# EAGLE design brick_serial_universal (EAGLE 7.4.0)
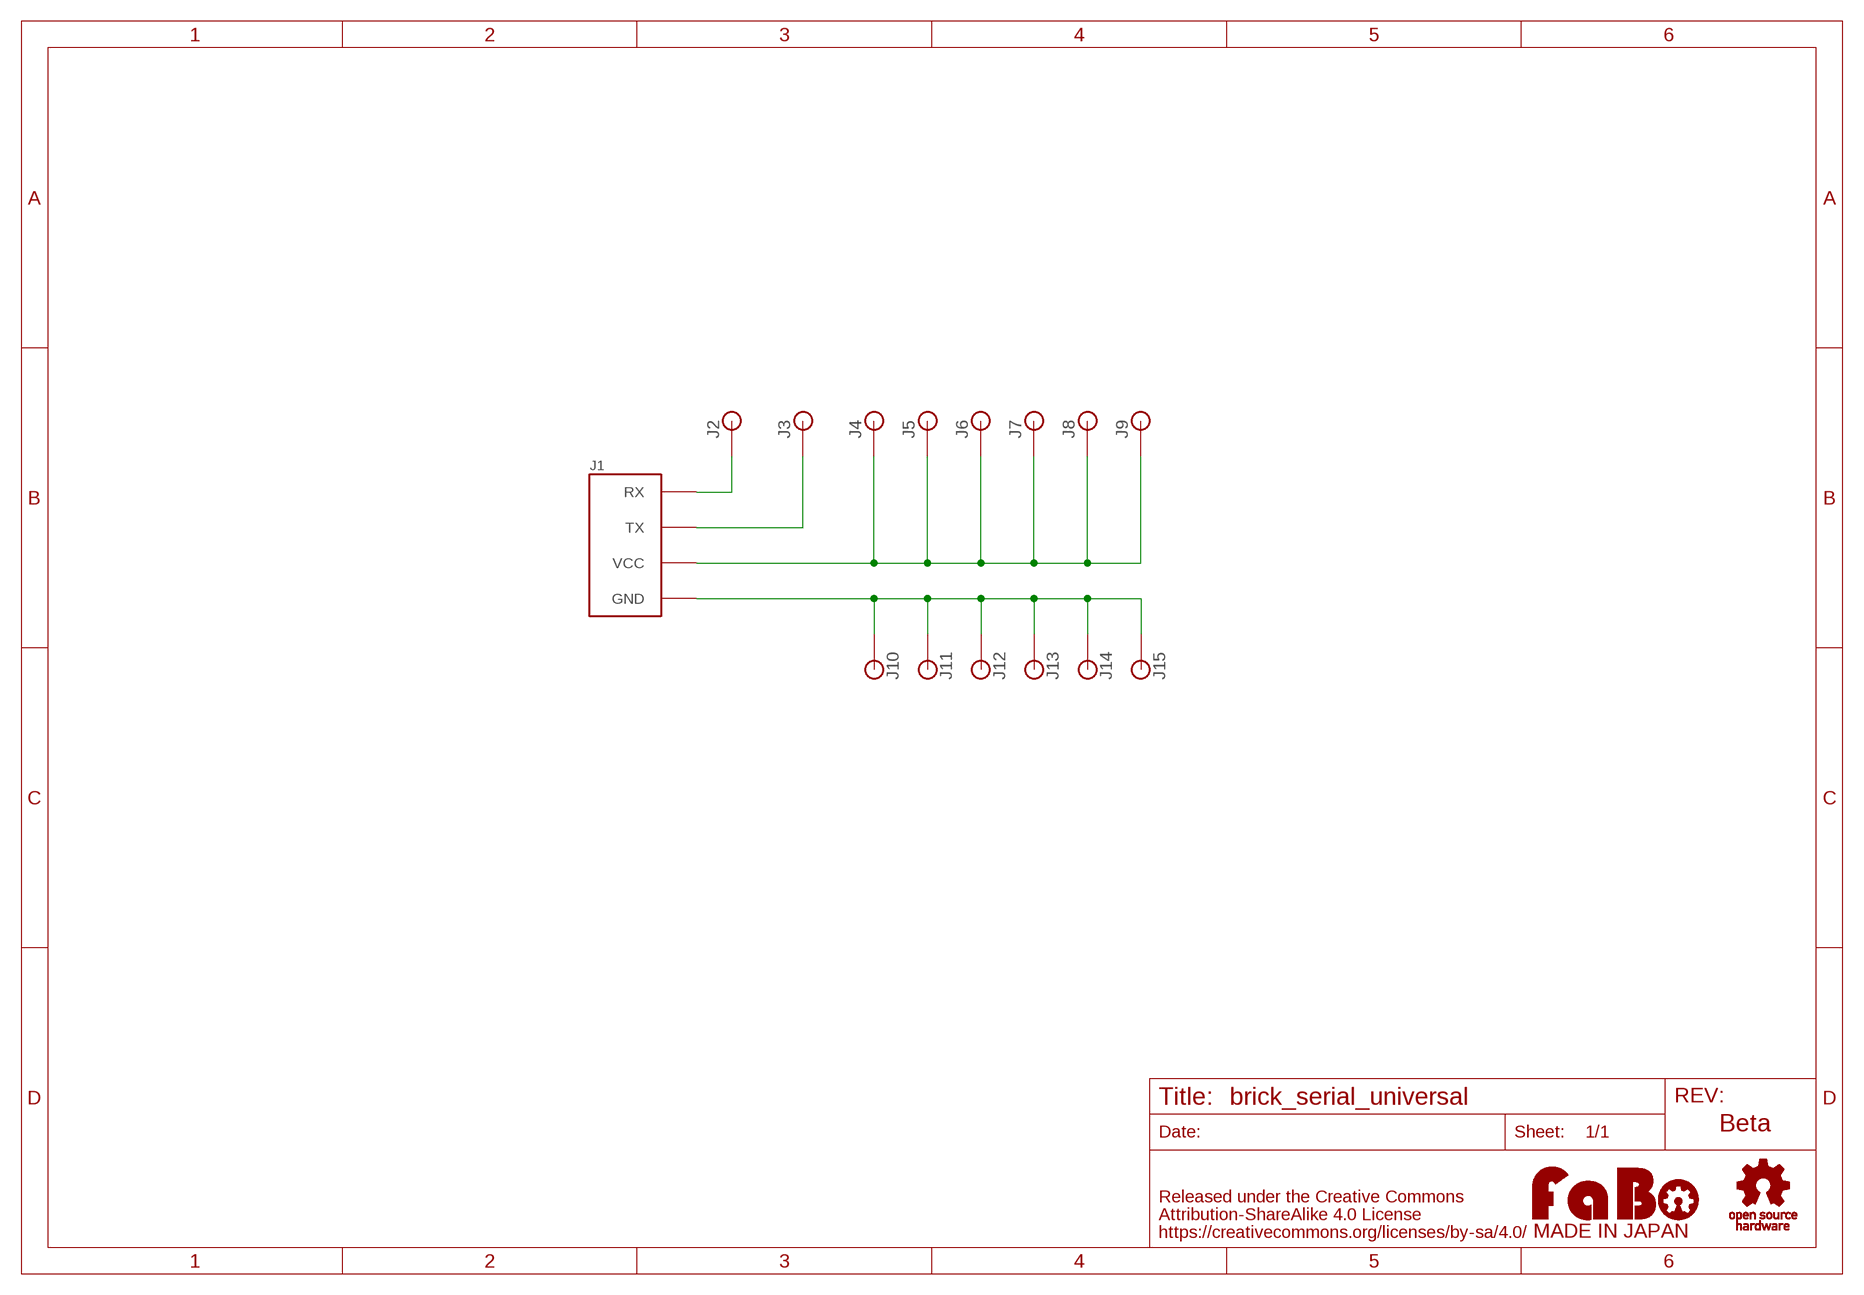
[diagram p0: schematic, sheet 1]

## Parts
J1  FABO_BRICK_SERIAL-UNIVERSAL  [FABO_BRICK_SERIAL_UNIVERSAL]
J2  PINHEAD_1X1-NONAME  [PIN_1X1_NONAME]
J3  PINHEAD_1X1-NONAME  [PIN_1X1_NONAME]
J4  PINHEAD_1X1-NONAME  [PIN_1X1_NONAME]
J5  PINHEAD_1X1-NONAME  [PIN_1X1_NONAME]
J6  PINHEAD_1X1-NONAME  [PIN_1X1_NONAME]
J7  PINHEAD_1X1-NONAME  [PIN_1X1_NONAME]
J8  PINHEAD_1X1-NONAME  [PIN_1X1_NONAME]
J9  PINHEAD_1X1-NONAME  [PIN_1X1_NONAME]
J10  PINHEAD_1X1-NONAME  [PIN_1X1_NONAME]
J11  PINHEAD_1X1-NONAME  [PIN_1X1_NONAME]
J12  PINHEAD_1X1-NONAME  [PIN_1X1_NONAME]
J13  PINHEAD_1X1-NONAME  [PIN_1X1_NONAME]
J14  PINHEAD_1X1-NONAME  [PIN_1X1_NONAME]
J15  PINHEAD_1X1-NONAME  [PIN_1X1_NONAME]
U$2  LOGO_OSHW-S_BOTTOM  [LOGO_OSHW_S_BOTTOM]
U$3  LOGO_FABO-M_BOTTOM  [LOGO_FABO_M_BOTTOM]

## Nets
GND: J1.GND J10.1 J11.1 J12.1 J13.1 J14.1 J15.1
RX: J1.RX J2.1
TX: J1.TX J3.1
VCC: J1.VCC J4.1 J5.1 J6.1 J7.1 J8.1 J9.1

## Notes on the sheet
- Beta

## Library data of the parts
J1 = FaBo-Template:FABO_BRICK_SERIAL: FaBo Brick Serial
J2-J15 = FaBo-etc:PINHEAD_1X1
U$2 = FaBo-etc:LOGO_OSHW
U$3 = FaBo-etc:LOGO_FABO

## Board
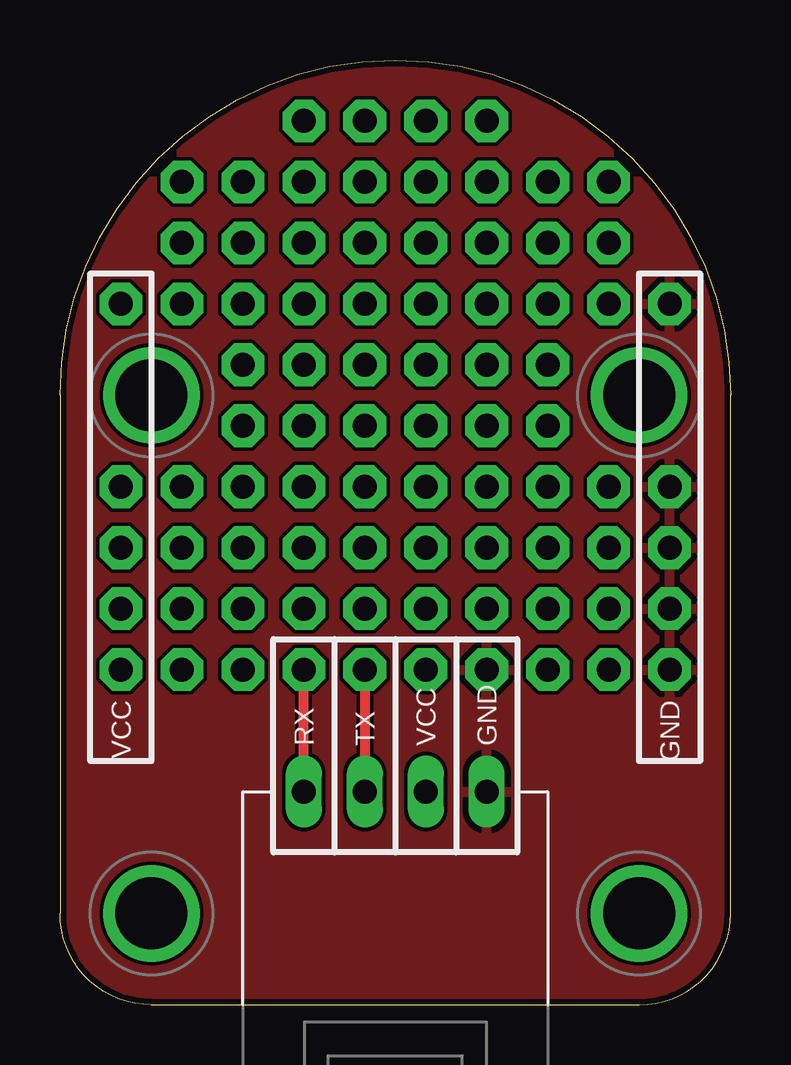
[diagram p1: board, top side]
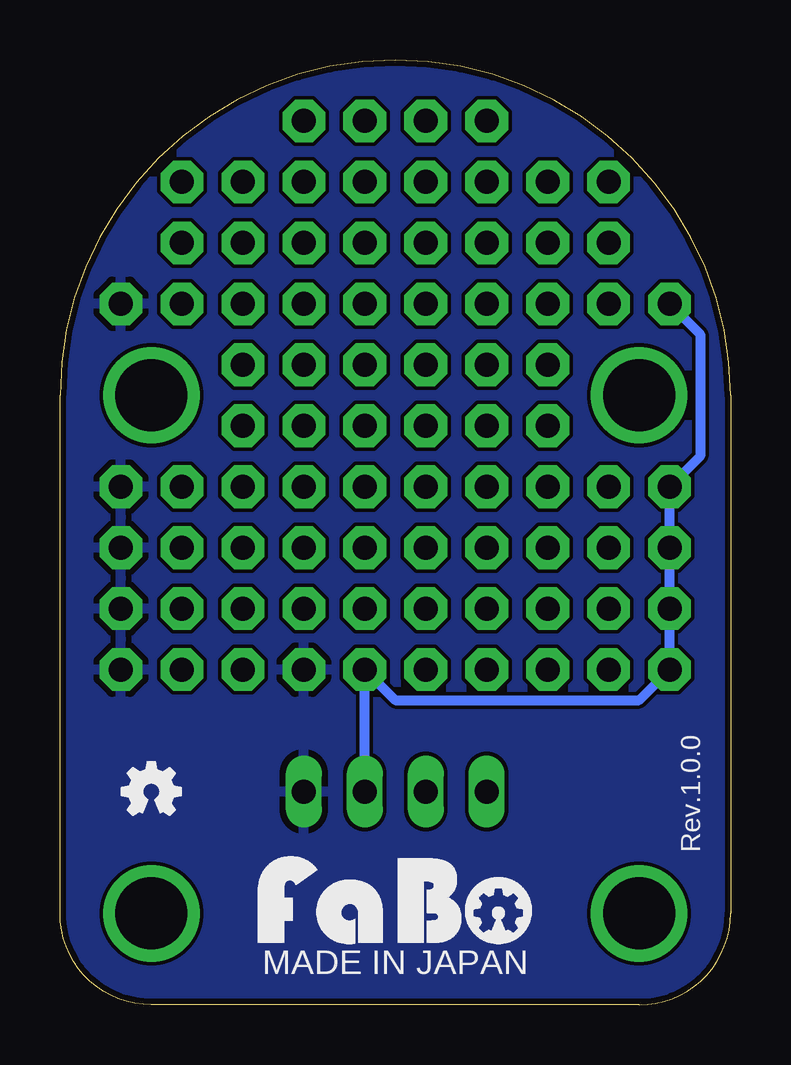
[diagram p2: board, bottom side, seen from below]

Size 27.94 x 39.37 mm. Coordinates in mm from the lower left corner, seen from the top.
Copper layers (1*16): Top 0.035mm / dielectric 1.5mm / Bottom 0.035mm
Design rules "Elecrow_2-layer_eagle_rule": minimum track width 6mil, minimum drill 12mil, track to track 6mil, track to pad 6mil, pad to pad 6mil, via to via 6mil, smd to smd 0mil, copper to edge 10mil, drill to drill 10mil, minimum pad ring 10mil, minimum via ring 6mil, stop-mask expansion 2mil, vias tented up to drill 100mil, thermal gap 10mil

### Footprints (pad centres in the part's own frame; a part is rotated, then mirrored left to right if it is on the bottom)
FABO_BRICK_SERIAL_UNIVERSAL = drill 1 long: GND 3.81,-10.16; RX -3.81,-10.16; TX -1.27,-10.16; VCC 1.27,-10.16 | drill 1 pad 1.778 octagon: P$1 -1.27,0; P$2 1.27,0; P$3 3.81,0; P$4 6.35,0; P$9 8.89,0; P$10 8.89,-2.54; P$11 -3.81,0; P$12 -6.35,0; P$13 -8.89,0; P$14 -8.89,-2.54; P$15 -1.27,-2.54; P$16 -3.81,-2.54; P$17 -6.35,-2.54; P$18 1.27,-2.54; P$19 3.81,-2.54; P$20 6.35,-2.54; P$21 6.35,-5.08; P$22 8.89,-5.08; P$23 -6.35,-5.08; P$24 -8.89,-5.08; P$25 -8.89,2.54; P$26 -6.35,2.54; P$27 -3.81,2.54; P$28 -1.27,2.54; P$29 1.27,2.54; P$30 3.81,2.54; P$31 6.35,2.54; P$32 8.89,2.54; P$33 -6.35,5.08; P$34 -3.81,5.08; P$35 -1.27,5.08; P$36 1.27,5.08; P$37 3.81,5.08; P$38 6.35,5.08; P$39 -6.35,7.62; P$40 -3.81,7.62; P$41 -1.27,7.62; P$42 1.27,7.62; P$43 3.81,7.62; P$44 6.35,7.62; P$45 -6.35,10.16; P$46 -3.81,10.16; P$47 -1.27,10.16; P$48 1.27,10.16; P$49 3.81,10.16; P$50 6.35,10.16; P$51 -8.89,10.16; P$52 8.89,10.16; P$53 -8.89,12.7; P$54 -8.89,15.24; P$55 -6.35,12.7; P$56 -3.81,12.7; P$57 -1.27,12.7; P$58 1.27,12.7; P$59 3.81,12.7; P$60 6.35,12.7; P$61 8.89,12.7; P$62 -6.35,15.24; P$63 -3.81,15.24; P$64 -1.27,15.24; P$65 1.27,15.24; P$66 3.81,15.24; P$67 6.35,15.24; P$68 8.89,15.24; P$69 -3.81,17.78; P$70 -1.27,17.78; P$71 1.27,17.78; P$72 3.81,17.78 | drill 3 pad 3.81: P$5 -10.16,6.35; P$6 10.16,6.35; P$7 -10.16,-15.24; P$8 10.16,-15.24
PIN_1X1_NONAME = drill 1 pad 1.778 octagon: 1 0,0

### Placement (x,y rotation side)
J1  13.97,19.05 0 top
J2  10.16,13.97 0 top
J3  12.7,13.97 0 top
J4  15.24,13.97 0 top
J5  2.54,13.97 0 top
J6  2.54,16.51 0 top
J7  2.54,19.05 0 top
J8  2.54,21.59 0 top
J9  2.54,29.21 0 top
J10  25.4,29.21 0 top
J11  25.4,21.59 0 top
J12  25.4,19.05 0 top
J13  17.78,13.97 0 top
J14  25.4,13.97 0 top
J15  25.4,16.51 0 top
U$2  24.13,8.89 0 top
U$3  13.97,2.54 0 top

### Tracks (layer width: path | path; a pad name or v marks a point on that pad's centre or on a via)
GND
  pour Bottom: -1.27,-1.27 29.21,-1.27 29.21,40.64 -1.27,40.64
  pour Top: -1.27,-1.27 29.21,-1.27 29.21,40.64 -1.27,40.64
RX
  Top 0.406: J1.RX J2.1
TX
  Top 0.406: J3.1 J1.TX
VCC
  Bottom 0.406: J1.VCC J4.1 13.97,12.7 3.81,12.7 J5.1 J6.1 J7.1 J8.1 1.27,22.86 1.27,27.94 J9.1

### Text on the board
tPlace: VCC | GND
bPlace: Rev.1.0.0 | MADE IN JAPAN